# Altium schematic sheet Motor Control.SchDoc
size A4
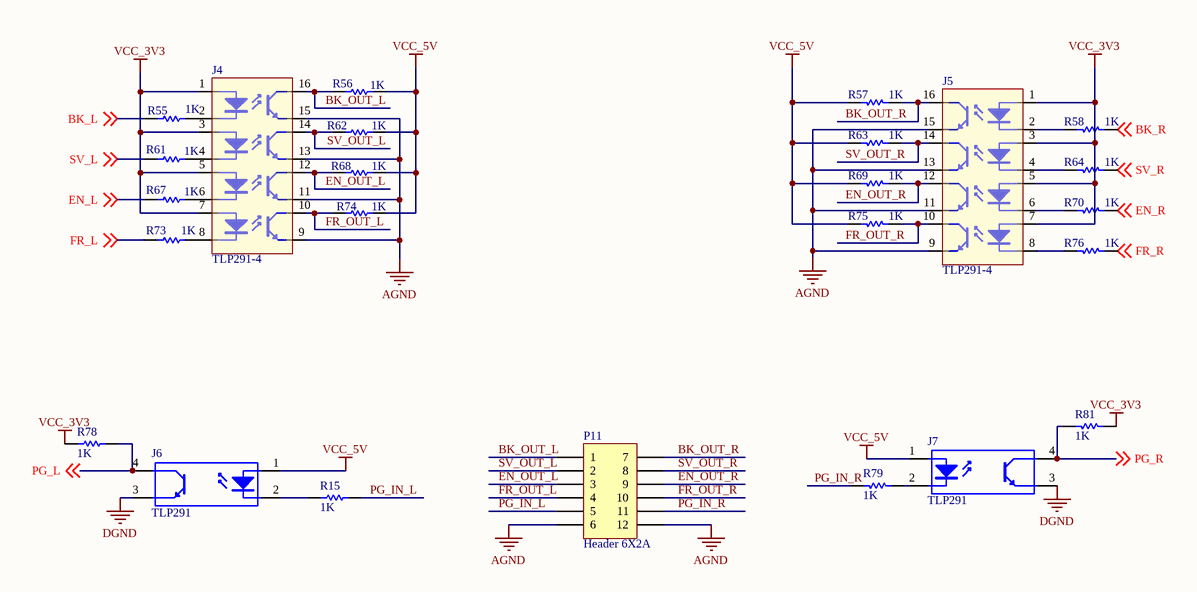
[diagram p0: Motor Control.SchDoc]

## Parts
J4  TLP291-4
J5  TLP291-4
J6  TLP291  [SOP127P710X350-4N]
J7  TLP291  [SOP127P710X350-4N]
P11  Header 6X2A  [Molex-12P]
R15  value 1K  [0805-1]  (hidden comment: 1K 5% 1/16W 0805)
R55  value 1K  [0805-1]  (hidden comment: 1K 5% 1/16W 0805)
R56  value 1K  [0805-1]  (hidden comment: 1K 5% 1/16W 0805)
R57  value 1K  [0805-1]  (hidden comment: 1K 5% 1/16W 0805)
R58  value 1K  [0805-1]  (hidden comment: 1K 5% 1/16W 0805)
R61  value 1K  [0805-1]  (hidden comment: 1K 5% 1/16W 0805)
R62  value 1K  [0805-1]  (hidden comment: 1K 5% 1/16W 0805)
R63  value 1K  [0805-1]  (hidden comment: 1K 5% 1/16W 0805)
R64  value 1K  [0805-1]  (hidden comment: 1K 5% 1/16W 0805)
R67  value 1K  [0805-1]  (hidden comment: 1K 5% 1/16W 0805)
R68  value 1K  [0805-1]  (hidden comment: 1K 5% 1/16W 0805)
R69  value 1K  [0805-1]  (hidden comment: 1K 5% 1/16W 0805)
R70  value 1K  [0805-1]  (hidden comment: 1K 5% 1/16W 0805)
R73  value 1K  [0805-1]  (hidden comment: 1K 5% 1/16W 0805)
R74  value 1K  [0805-1]  (hidden comment: 1K 5% 1/16W 0805)
R75  value 1K  [0805-1]  (hidden comment: 1K 5% 1/16W 0805)
R76  value 1K  [0805-1]  (hidden comment: 1K 5% 1/16W 0805)
R78  value 1K  [0805-1]  (hidden comment: 1K 5% 1/16W 0805)
R79  value 1K  [0805-1]  (hidden comment: 1K 5% 1/16W 0805)
R81  value 1K  [0805-1]  (hidden comment: 1K 5% 1/16W 0805)

## Nets
AGND: J4.9(E) J4.11(E) J4.13(E) J4.15(E) J5.9(E) J5.11(E) J5.13(E) J5.15(E) P11.6 P11.12
DGND: J6.3(E) J7.3(E)
VCC_3V3: J4.1(A) J4.3(A) J4.5(A) J4.7(A) J5.1(A) J5.3(A) J5.5(A) J5.7(A) R78.2 R81.2
VCC_5V: J6.1(A) J7.1(A) R56.2 R57.2 R62.2 R63.2 R68.2 R69.2 R74.2 R75.2
BK_L: R55.2 ; off-sheet BK_L
BK_OUT_L: J4.16(C) P11.1 R56.1
BK_OUT_R: J5.16(C) P11.7 R57.1
BK_R: R58.2 ; off-sheet BK_R
EN_L: R67.2 ; off-sheet EN_L
EN_OUT_L: J4.12(C) P11.3 R68.1
EN_OUT_R: J5.12(C) P11.9 R69.1
EN_R: R70.2 ; off-sheet EN_R
FR_L: R73.2 ; off-sheet FR_L
FR_OUT_L: J4.10(C) P11.4 R74.1
FR_OUT_R: J5.10(C) P11.10 R75.1
FR_R: R76.2 ; off-sheet FR_R
PG_IN_L: P11.5 R15.1
PG_IN_R: P11.11 R79.1
PG_L: J6.4(C) R78.1 ; off-sheet PG_L
PG_R: J7.4(C) R81.1 ; off-sheet PG_R
SV_L: R61.2 ; off-sheet SV_L
SV_OUT_L: J4.14(C) P11.2 R62.1
SV_OUT_R: J5.14(C) P11.8 R63.1
SV_R: R64.2 ; off-sheet SV_R
NetJ4_2: J4.2(K) R55.1
NetJ4_4: J4.4(K) R61.1
NetJ4_6: J4.6(K) R67.1
NetJ4_8: J4.8(K) R73.1
NetJ5_2: J5.2(K) R58.1
NetJ5_4: J5.4(K) R64.1
NetJ5_6: J5.6(K) R70.1
NetJ5_8: J5.8(K) R76.1
NetJ6_2: J6.2(K) R15.2
NetJ7_2: J7.2(K) R79.2

## Notes on the sheet
- Labels drawn without touching a wire or pin: /, =Date, =DocumentName, =DocumentNumber, =Engineer, =ProjectName, =Revision, =SheetNumber, =Time, Checkedby：, Date：, DocumentName：, DocumentNumber/SheetNumber：, Engineer：, ProjectName：, Revision：, Time：

## Library data of the parts
J4 J5 = TLP291-4: 光耦
J6 J7 = TLP291: 光耦; Published: 24-Mar-1999; LatestRevisionDate: 04-Mar-2005; LatestRevisionNote: Sch pins 3 & 4 Swapped.; DatasheetDocument: Nov-2003; PackageReference: DIP-4; Publisher: Altium Limited
P11 = Header 6X2A: Header, 6-Pin, Dual row; LatestRevisionDate: 17-Jul-2002; LatestRevisionNote: Re-released for DXP Platform.; Publisher: Altium Limited
R15 R55-R58 R61-R64 R67-R70 R73-R76 R78 R79 R81 = Res1: Resistor; Published: 8-Jun-2000; LatestRevisionDate: 17-Jul-2002; LatestRevisionNote: Re-released for DXP Platform.; PackageReference: AXIAL-0.3; Publisher: Altium Limited; PackageDescription: Axial Device, Thru-Hole; 2 Leads; 0.3 in Pin Spacing